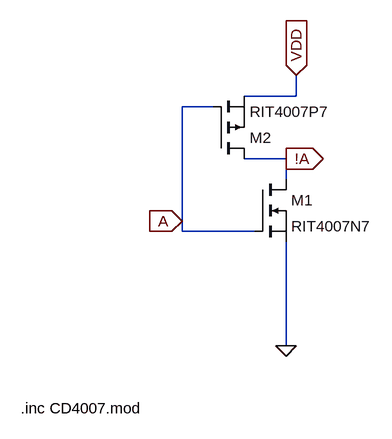
[diagram p0: schematic Gate_NOT.asc]
Gate_NOT.asc, the LTspice schematic file:
Version 4
SHEET 1 880 680
WIRE 64 -112 64 -144
WIRE 64 -112 -16 -112
WIRE -64 -96 -112 -96
WIRE 48 -16 -16 -16
WIRE 48 16 48 -16
WIRE -112 80 -112 -96
WIRE -112 96 -112 80
WIRE 0 96 -112 96
WIRE 48 272 48 112
FLAG 48 272 0
FLAG -112 80 A
IOPIN -112 80 In
FLAG 48 -16 !A
IOPIN 48 -16 Out
FLAG 64 -144 VDD
IOPIN 64 -144 In
SYMBOL nmos 0 16 R0
SYMATTR InstName M1
SYMATTR Value RIT4007N7
SYMBOL pmos -64 -16 M180
SYMATTR InstName M2
SYMATTR Value RIT4007P7
TEXT -360 368 Left 2 !.inc CD4007.mod

The netlist it stands for:
* Gate_NOT.asc
M1 !A A 0 0 RIT4007N7
M2 !A A VDD VDD RIT4007P7
.model NMOS NMOS
.model PMOS PMOS
.lib standard.mos
.inc CD4007.mod
.backanno
.end